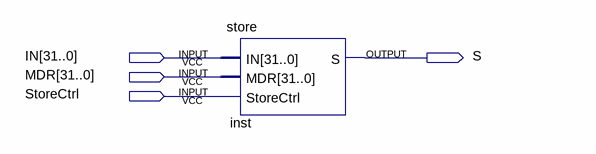
[diagram p0: schematic sheet]
// Quartus schematic BlockStore.bdf as structural Verilog: 1 symbols, 4 pins
module BlockStore (
  input  [31:0] IN,
  input  [31:0] MDR,
  input  StoreCtrl,
  output S
);

  store inst (.IN(IN), .MDR(MDR), .StoreCtrl(StoreCtrl), .S(S));
endmodule
